# EAGLE design pc_healthypi_move_finger_sensor_v2 (EAGLE 9.6.2)
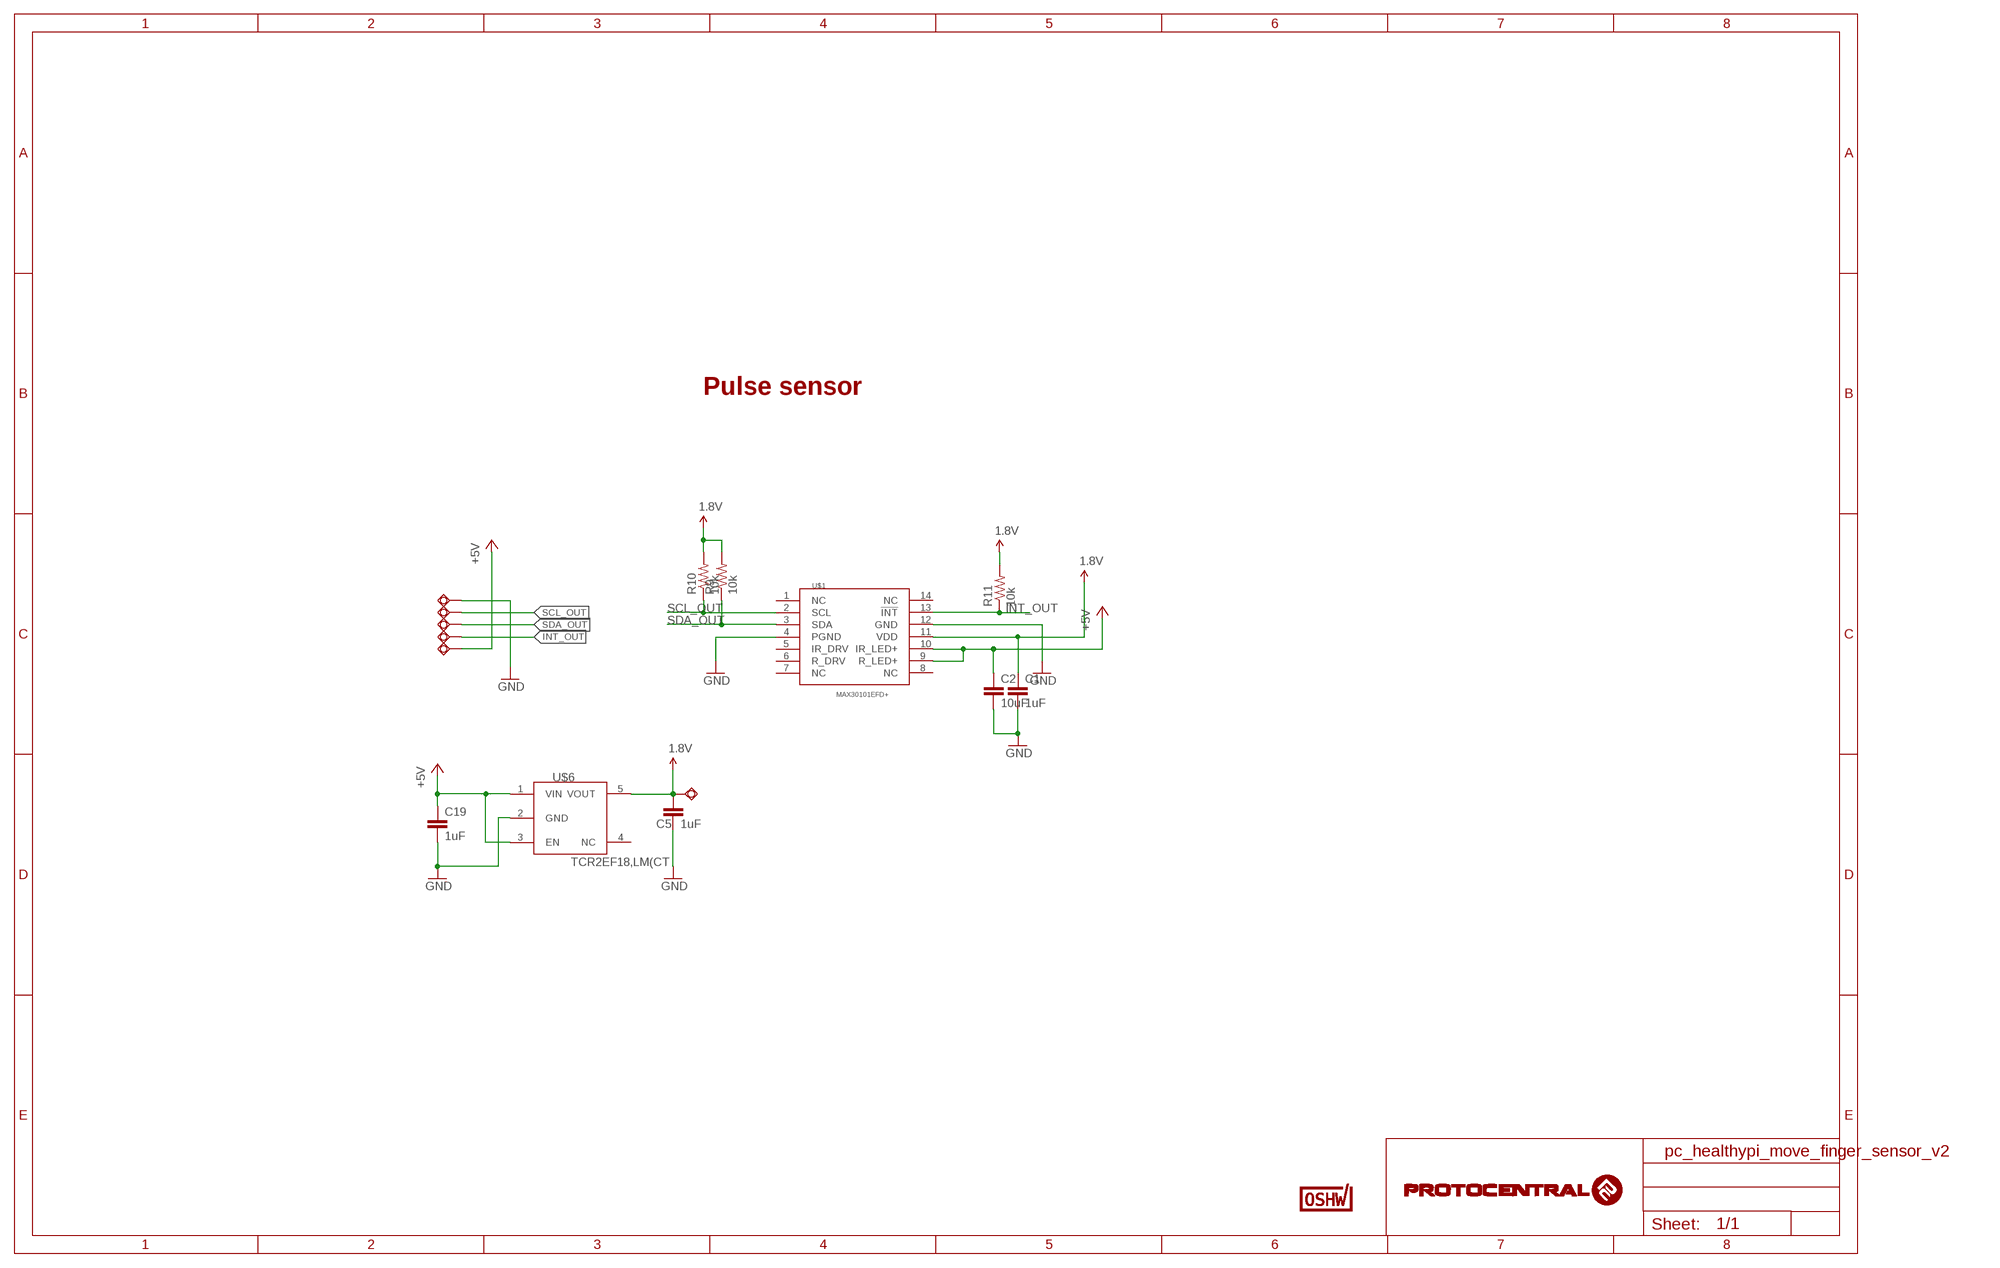
[diagram p0: schematic, sheet 1]

## Parts
C1  1uF  C-EUC0402  [C0402]
C2  10uF  C-EUC0402  [C0402]
C5  1uF  C-EUC0402  [C0402]
C19  1uF  C-EUC0402  [C0402]
R9  10k  R-US_R0402  [R0402]
R10  10k  R-US_R0402  [R0402]
R11  10k  R-US_R0402  [R0402]
SWIO1  TPSQTP11R  [TP11R]
SWIO2  TPSQTP11R  [TP11R]
SWIO3  TPSQTP11R  [TP11R]
SWIO4  TPSQTP11R  [TP11R]
SWIO5  TPSQTP11R  [TP11R]
SWIO6  TPSQTP11R  [TP11R]
U$1  MAX30101EFD+  MAX30100  [OESIP-14]
U$6  TCR2EF18,LM(CT  AP7354D-18W5-7  [SOT95P285X140-5N]
U$9  CERT-SMALL  [CERT-SMALL-SILK]

## Nets
1.8V: C1.1 C5.1 R9.2 R10.2 R11.2 SWIO5.TP U$1.11(VDD) U$6.5(VOUT)
+5V: C2.1 C19.1 SWIO4.TP U$1.9(R_LED+) U$1.10(IR_LED+) U$6.1(VIN) U$6.3(EN)
GND: C1.2 C2.2 C5.2 C19.2 SWIO6.TP U$1.4(PGND) U$1.12(GND) U$6.2(GND)
INT_OUT: R11.1 SWIO3.TP U$1.13(!INT)
SCL_OUT: R10.1 SWIO1.TP U$1.2(SCL)
SDA_OUT: R9.1 SWIO2.TP U$1.3(SDA)
Unconnected: U$1.1(NC) U$1.5(IR_DRV) U$1.6(R_DRV) U$1.7(NC) U$1.8(NC) U$1.14(NC) U$6.4(NC)

## Notes on the sheet
- Pulse sensor

## Library data of the parts
C1 C2 C5 C19 = rcl:C-EU: CAPACITOR, European symbol; SPICEPREFIX: C
R9-R11 = rcl:R-US_: RESISTOR, American symbol; SPICEPREFIX: R
SWIO1-SWIO6 = testpad:TPSQ: Test pad
U$1 = circuitects:MAX30100
U$6 = circuitects:AP7354D-18W5-7
U$9 = OSHWA:CERT

## Net classes
2 gnd: width 0.102 mm, drill 0.1 mm

## Board
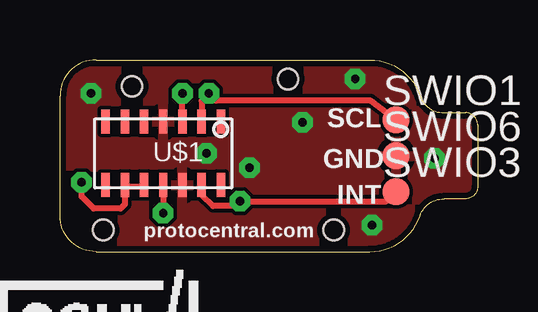
[diagram p1: board, top side]
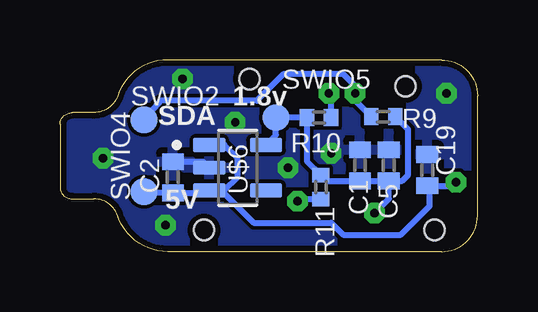
[diagram p2: board, bottom side, seen from below]

Size 17.4 x 8 mm. Coordinates in mm from the lower left corner, seen from the top.
Outline: 1.5,0 12.9,0 arc71 15,1.5 arc-72 16,2.2 16.9,2.2 arc90 17.4,2.7 17.4,5.3 arc90 16.9,5.8 16,5.8 arc-72 15,6.5 arc71 12.9,8 1.5,8 arc90 0,6.5 0,1.5 arc90 1.5,0
Copper layers (1*16): Top 0.035mm / dielectric 1.5mm / Bottom 0.035mm
Design rules "Circuitects-Rules *": minimum track width 6mil, minimum drill 0.3mm, track to track 6mil, track to pad 6mil, pad to pad 6mil, via to via 6mil, smd to smd 6mil, copper to edge 10mil, drill to drill 8mil, minimum pad ring 12mil, minimum via ring 10mil, stop-mask expansion 4mil, vias tented up to drill 25mil, thermal gap 10mil
Holes 0.85 mm at 3,6.9 11.4,0.9 9.5,7.2 1.8,0.9

### Footprints (pad centres in the part's own frame; a part is rotated, then mirrored left to right if it is on the bottom)
C0402 = smd 0.7 x 0.9: 1 -0.65,0; 2 0.65,0
R0402 = smd 0.6 x 0.7: 1 -0.5,0; 2 0.5,0
TP11R = smd 1.1 x 1.1: TP 0,0
OESIP-14 = smd 1 x 0.35: 1 -1.325,2.4; 2 -1.325,1.6; 3 -1.325,0.8; 4 -1.325,0; 5 -1.325,-0.8; 6 -1.325,-1.6; 7 -1.325,-2.4; 8 1.325,-2.4; 9 1.325,-1.6; 10 1.325,-0.8; 11 1.325,0; 12 1.325,0.8; 13 1.325,1.6; 14 1.325,2.4
SOT95P285X140-5N = smd 1.35 x 0.6: 1 -1.185,0.95; 2 -1.185,0; 3 -1.185,-0.95; 4 1.185,-0.95; 5 1.185,0.95

### Placement (x,y rotation side)
C1  4.9,3.6 90 bottom
C2  12.7,3.1 90 bottom
C5  3.7,3.6 90 bottom
C19  2.1,3.4 90 bottom
R9  3.93,5.63 0 bottom
R10  6.61,5.59 180 bottom
R11  6.53,2.69 90 bottom
SWIO1  14,5.5 0 top
SWIO2  13.9,5.5 0 bottom
SWIO3  14,2.5 0 top
SWIO4  13.9,2.5 0 bottom
SWIO5  8.4,5.6 0 bottom
SWIO6  14,4 0 top
U$1  4.3,4.1 270 top
U$6  10,3.5 0 bottom
U$9  1.6,-5.1 0 top  (outside the outline)

### Tracks (layer width: path | path; a pad name or v marks a point on that pad's centre or on a via)
1.8V  (via drill 0.35)
  Top 0.254: U$1.11 v4.3,1.6
  Bottom 0.254: v4.3,1.6 3.7,2.2 C5.1 | C5.1 C1.1 6.29,2.95 R11.2 7.11,3.77 R10.2 SWIO5.TP 8.4,4.87 U$6.5 | C5.1 3.15,2.95 2.9,3.2 2.9,5.1 R9.2
+5V  (via drill 0.35)
  Top 0.254: U$1.9 2.7,2.7 | 2.7,2.7 2.7,1.98 2.52,1.8 1.4,1.8 0.9,2.3 v0.9,2.9 | U$1.10 3.42,2.7 2.7,2.7
  Bottom 0.254: C19.1 2,2.75 | 2,2.75 1.05,2.75 v0.9,2.9 | U$6.3 10.55,2.55 10,3.1 10,3.9 10.55,4.45 U$6.1 | U$6.3 11.29,2.45 C2.1 13.85,2.45 13.9,2.4 SWIO4.TP | U$6.3 10.69,2.55 9.34,1.2 6.1,1.2 5.6,0.7 3.2,0.7 2,1.9 2,2.75
GND  (via drill 0.35)
  Bottom 0.254: U$6.2 11.44,3.75 C2.2
  other vias: 6.1,4.1 1.3,6.6 7.9,3.5 10.1,5.4 15.6,3.9 12.3,7.2 13,1.1
  pour Top: 0,8.2 18.6,8.2 18.6,0 0,0
  pour Bottom: 0,8.3 18.6,8.3 18.6,0 0,0
INT_OUT  (via drill 0.35)
  Top 0.254: U$1.13 5.9,2.38 6.38,1.9 7.3,1.9 v7.5,2.1 13.6,2.1 SWIO3.TP
  Bottom 0.254: v7.5,2.1 7.41,2.19 R11.1
SCL_OUT  (via drill 0.35)
  Top 0.254: U$1.2 5.9,6.3 v6.2,6.6 6.5,6.3 12.95,6.3 SWIO1.TP
  Bottom 0.254: R10.1 6.1,6.5 v6.2,6.6
SDA_OUT  (via drill 0.35)
  Top 0.254: U$1.3 v5.1,6.6
  Bottom 0.254: R9.1 5.1,6.3 v5.1,6.6 5.1,6.9 5.6,7.4 8.1,7.4 9.2,6.3 13.2,6.3 SWIO2.TP

### Text on the board
tPlace: SCL | GND | INT | protocentral.com
bPlace: 1.8v | SDA | 5V